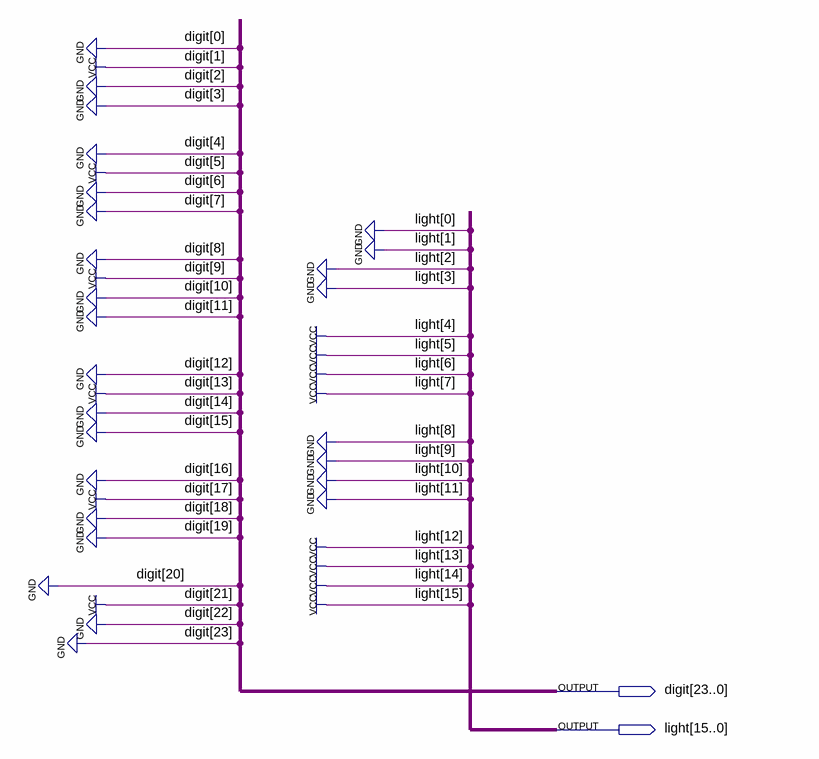
[diagram p0: schematic sheet]
// Quartus schematic Pattern_1_Frame_11.bdf as structural Verilog: 0 symbols, 2 pins
module Pattern_1_Frame_11 (
  output [23:0] digit,
  output [15:0] light
);


  assign digit = 24'b001000100010001000100010;
  assign light = 16'b1111000011110000;
endmodule
